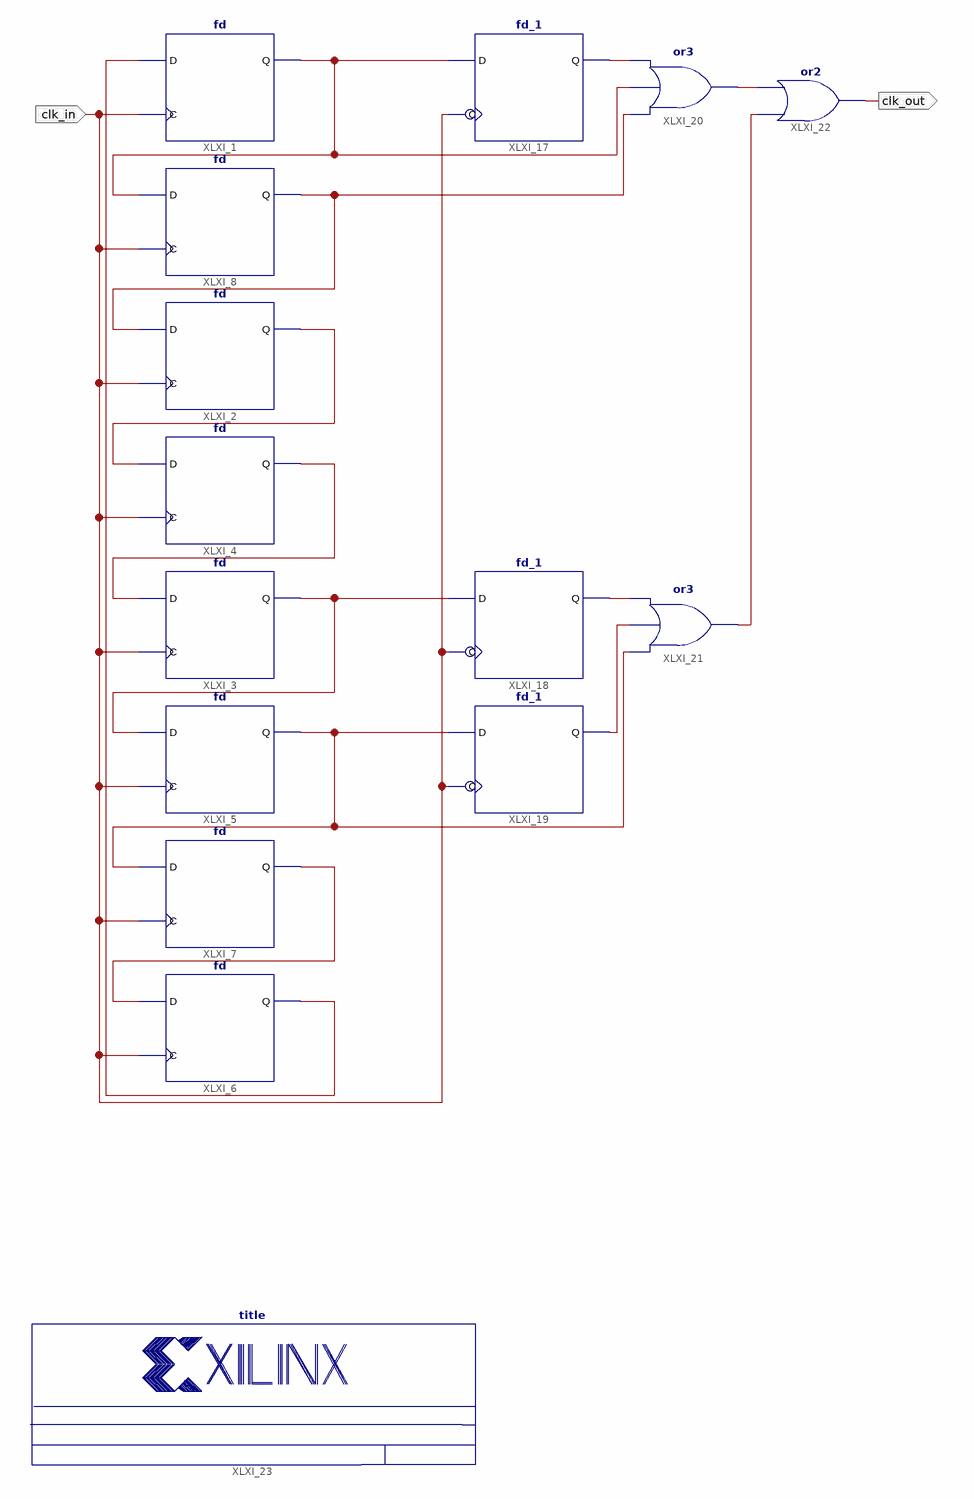
[diagram p0: schematic sheet 1]
// Xilinx ISE schematic CLKDIV_4dot5.sch (spartan3e) as structural Verilog: 15 symbols, 2 ports
module CLKDIV_4dot5 (
  input  clk_in,
  output clk_out
);

  wire XLXN_59, XLXN_60, XLXN_62, XLXN_63, XLXN_64, XLXN_65, XLXN_66, XLXN_67, XLXN_78, XLXN_80, XLXN_81,
       XLXN_83, XLXN_84;

  fd #(.INIT("1")) XLXI_1 (.C(clk_in), .D(XLXN_67), .Q(XLXN_59));
  fd XLXI_8 (.C(clk_in), .D(XLXN_59), .Q(XLXN_60));
  fd XLXI_2 (.C(clk_in), .D(XLXN_60), .Q(XLXN_62));
  fd XLXI_4 (.C(clk_in), .D(XLXN_62), .Q(XLXN_63));
  fd XLXI_3 (.C(clk_in), .D(XLXN_63), .Q(XLXN_64));
  fd XLXI_5 (.C(clk_in), .D(XLXN_64), .Q(XLXN_65));
  fd XLXI_7 (.C(clk_in), .D(XLXN_65), .Q(XLXN_66));
  fd XLXI_6 (.C(clk_in), .D(XLXN_66), .Q(XLXN_67));
  fd_1 XLXI_18 (.C(clk_in), .D(XLXN_64), .Q(XLXN_80));
  fd_1 XLXI_19 (.C(clk_in), .D(XLXN_65), .Q(XLXN_81));
  fd_1 XLXI_17 (.C(clk_in), .D(XLXN_59), .Q(XLXN_78));
  or XLXI_20 (XLXN_83, XLXN_60, XLXN_59, XLXN_78);
  or XLXI_21 (XLXN_84, XLXN_65, XLXN_81, XLXN_80);
  or XLXI_22 (clk_out, XLXN_84, XLXN_83);
  title #(.NameFieldText("Karthik Vippala")) XLXI_23 ();
endmodule
